# EAGLE design EL_Inverter (EAGLE 7.2.0)
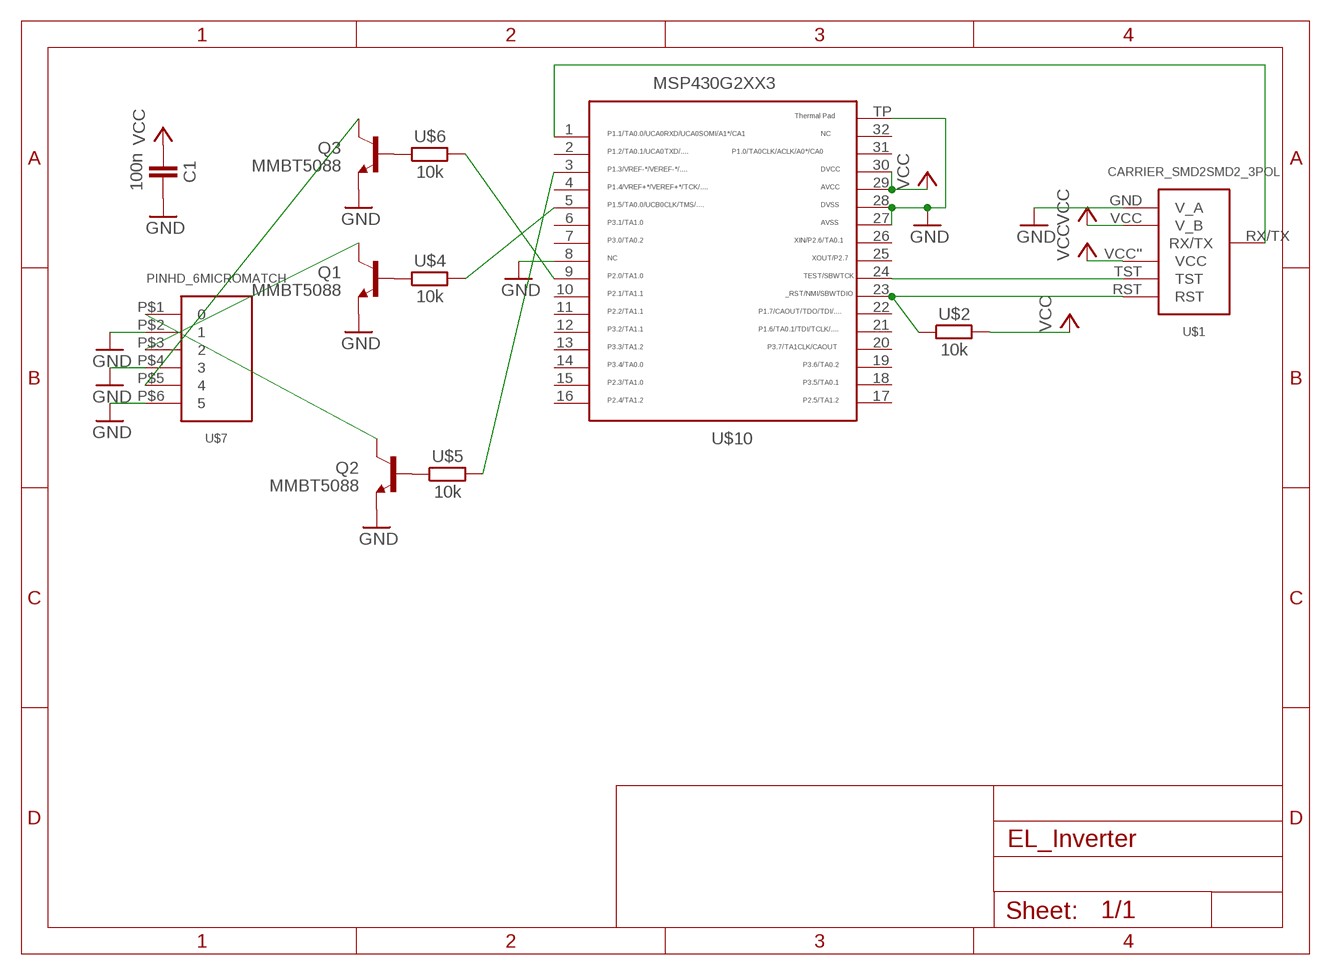
[diagram p0: schematic, sheet 1]

## Parts
C1  100n  CAPACITOR  [603]
Q1  MMBT5088  TRANSISTOR_NPNMMBT5088  [SOT23-3]
Q2  MMBT5088  TRANSISTOR_NPNMMBT5088  [SOT23-3]
Q3  MMBT5088  TRANSISTOR_NPNMMBT5088  [SOT23-3]
U$1  CARRIER_SMD2SMD2_3POL  [CARRIER_SMD2_3POL]
U$2  10k  RESISTOR0603  [603]
U$4  10k  RESISTOR0603  [603]
U$5  10k  RESISTOR0603  [603]
U$6  10k  RESISTOR0603  [603]
U$7  PINHD_6MICROMATCH  [MICROMATCH6POL]
U$10  MSP430G2553  [QFN32]

## Nets
GND: C1.2 Q1.2(E) Q2.2(E) Q3.2(E) U$1.GND(V_A) U$7.P$2 U$7.P$4 U$7.P$6 U$10.8 U$10.27 U$10.28 U$10.TP
N$2: Q1.1(B) U$4.1
N$3: U$1.TST U$10.24
N$4: U$1.RST U$2.1 U$10.23
N$5: Q2.1(B) U$5.1
N$6: Q2.3(C) U$7.P$1
N$7: Q1.3(C) U$7.P$3
N$11: Q3.1(B) U$6.1
N$12: U$1.RX/TX U$10.1
N$13: Q3.3(C) U$7.P$5
N$14: U$5.2 U$10.3
N$16: U$4.2 U$10.5
N$17: U$6.2 U$10.9
VCC: C1.1 U$1.VCC''(VCC) U$1.VCC(V_B) U$2.2 U$10.29 U$10.30
Unconnected: U$10.2 U$10.4 U$10.6 U$10.7 U$10.10 U$10.11 U$10.12 U$10.13 U$10.14 U$10.15 U$10.16 U$10.17 U$10.18 U$10.19 U$10.20 U$10.21 U$10.22 U$10.25 U$10.26 U$10.31 U$10.32

## Library data of the parts
C1 = thar:CAPACITOR
Q1-Q3 = SparkFun-DiscreteSemi:TRANSISTOR_NPN: Generic NPN BJT MMBT2222A - TRANS-08049 (SOT-23, 1A 40V) MPSA42 - TRANS-09116 (SOT-23, 500mA 300V) MMBT5088LT1G - TRANS-11160 (SOT-23, 50 mA 30V) BC547 - COM-08928 <http://www.sparkfun.com/products/8928> (TO-92 45V 100mA) (1.Collector 2.Base 3.Emitter) 2N3904 - COM-00521 <http://www.sparkfun.com/products/521> (TO-92 40V 200mA) (1.Emitter 2.Base 3.Collector) P2N2222A - COM-12852 <http://www.sparkfun.com/products/12852> (TO-92 40V 600mA) (1.Collector 2.Base 3.Emitter); PROD_ID: TRANS-11160
U$1 = thar:CARRIER_SMD2
U$2 U$4-U$6 = thar:RESISTOR
U$7 = thar:PINHD_6
U$10 = thar:MSP430G2553: TEXAS INSTRUMENTS MSP430G2553IRHB32R MCU, 16BIT, MSP430, 16MHZ, QFN-32 Farnell Best.Nr.: 2325726 Herst.Bez.: MSP430G2553IRHB32R

## Board
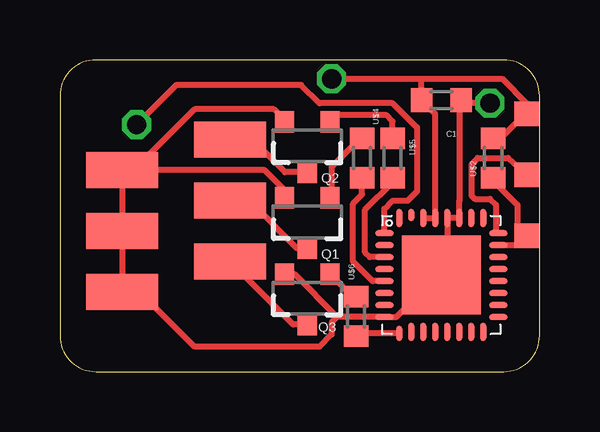
[diagram p1: board, top side]
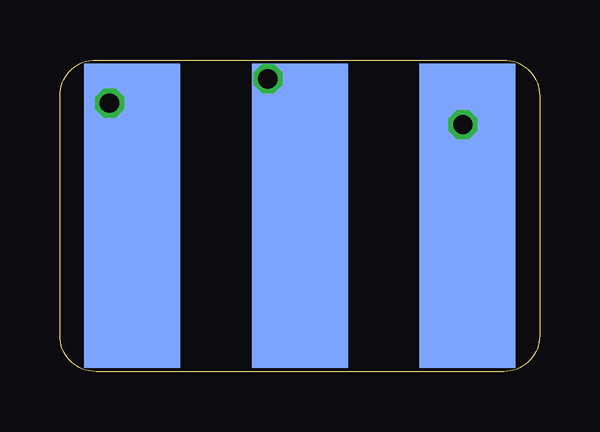
[diagram p2: board, bottom side, seen from below]

Size 20 x 13 mm. Coordinates in mm from the lower left corner, seen from the top.
Copper layers (1*16): Top 0.035mm / dielectric 1.5mm / Bottom 0.035mm
Design rules "Bilex DRU *": minimum track width 10mil, minimum drill 24mil, track to track 10mil, track to pad 10mil, pad to pad 10mil, via to via 10mil, smd to smd 10mil, copper to edge 1mil, drill to drill 8mil, minimum pad ring 10mil, minimum via ring 8mil, stop-mask expansion 4mil, vias tented up to drill 0mil, thermal gap 10mil

### Footprints (pad centres in the part's own frame; a part is rotated, then mirrored left to right if it is on the bottom)
603 = smd 0.889 x 1.016: 1 -0.826,0; 2 0.826,0
SOT23-3 = smd 0.8 x 0.9: 1 -0.95,-1; 2 0.95,-1; 3 0,1.1
CARRIER_SMD2_3POL = smd 4 x 12.7 bottom: GND -6.985,0; RX/TX 6.985,0; VCC 0,0 | smd 1.016 x 1.016: RST -9.461,0.826; TST -9.461,-1.714; VCC'' -9.461,-4.255
MICROMATCH6POL = smd 1.5 x 3: P$1 -3.175,2.25; P$2 -1.905,-2.25; P$3 -0.635,2.25; P$4 0.635,-2.25; P$5 1.905,2.25; P$6 3.175,-2.25
QFN32 = smd 0.762 x 0.254: 1 -2.375,1.75; 2 -2.375,1.25; 3 -2.375,0.75; 4 -2.375,0.25; 5 -2.375,-0.25; 6 -2.375,-0.75; 7 -2.375,-1.25; 8 -2.375,-1.75; 17 2.375,-1.75; 18 2.375,-1.25; 19 2.375,-0.75; 20 2.375,-0.25; 21 2.375,0.25; 22 2.375,0.75; 23 2.375,1.25; 24 2.375,1.75 | smd 0.254 x 0.635: 9 -1.75,-2.438 | smd 0.254 x 0.762: 10 -1.25,-2.375; 11 -0.75,-2.375; 12 -0.25,-2.375; 13 0.25,-2.375; 14 0.75,-2.375; 15 1.25,-2.375; 16 1.75,-2.375; 25 1.75,2.375; 26 1.25,2.375; 27 0.75,2.375; 28 0.25,2.375; 29 -0.25,2.375; 30 -0.75,2.375; 32 -1.75,2.375 | smd 0.254 x 0.508: 31 -1.25,2.5 | smd 3.302 x 3.302: TP 0,0

### Placement (x,y rotation side)
C1  15.9,11.32 0 top
Q1  10.31,6.24 180 top
Q2  10.31,9.42 180 top
Q3  10.31,3.07 180 top
U$1  10,6.5 180 top
U$2  18.06,8.91 90 top
U$4  12.6,8.91 270 top
U$5  13.87,8.91 270 top
U$6  12.35,2.31 270 top
U$7  4.85,6.5 270 top
U$10  15.9,4.03 0 top

### Tracks (layer width: path | path; a pad name or v marks a point on that pad's centre or on a via)
GND  (via drill 0.8)
  Top 0.254: 16.43,4.35 16.19,5.38 16.16,5.35 | 16.43,4.35 16.48,3.06 U$10.TP 15.01,2.94 14.89,3.14 14.03,2.28 U$10.8 11.56,2.28 | 16.15,4.72 U$10.28 U$10.27 16.65,7.12 16.66,7.13 16.66,11.26 C1.2 16.86,11.2 v17.93,11.2 | 16.15,4.72 16.15,4.42 16.43,4.35 | 14.76,5.55 15.52,5.35 16.15,4.72 | U$7.P$2 U$7.P$4 U$7.P$6 3.33,3.32 5.62,1.04 10.82,1.04 11.33,1.54 11.33,2.05 11.56,2.28 | Q2.2 9.37,10.49 8.92,10.94 5.62,10.94 3.46,8.78 2.99,8.78 U$7.P$2 | Q1.2 9.37,7.57 8.54,8.4 U$7.P$2 | Q3.2 9.77,4.07 11.56,2.28
  Bottom 0.254: 18,6.5 17.93,6.57 v17.93,11.2 16.98,10.25 U$1.GND
N$2
  Top 0.254: U$4.1 12.54,9.74 11.33,8.53 11.33,7.31 Q1.1
N$3
  Top 0.254: 19.61,7.88 19.46,8.02 19.5,8.18 | U$10.24 18.19,5.78 18.19,6.95 17.93,7.21 17.3,7.21 17.17,7.33 17.17,8.66 17.43,8.91 18.7,8.91 19.5,8.18 | 19.5,8.18 U$1.TST
N$4
  Top 0.254: 19.46,5.48 19.5,5.38 | 19.46,5.48 19.5,5.69 19.08,5.74 19.08,6.95 18.06,7.97 U$2.1 | U$10.23 19.28,5.28 19.46,5.48 | U$1.RST 19.46,5.48
N$5
  Top 0.254: U$5.1 13.87,10.43 13.62,10.69 11.54,10.69 Q2.1
N$6
  Top 0.254: Q2.3 9.38,8.32 8.28,9.42 7.36,9.42 U$7.P$1
N$7
  Top 0.254: Q1.3 9.89,5.14 7.9,7.13 U$7.P$3
N$11
  Top 0.254: U$6.1 12.2,3.13 Q3.1
N$12  (via drill 0.8)
  Top 0.254: v3.2,10.31 4.85,11.96 10.06,11.96 10.82,11.2 13.87,11.2 14.89,10.18 14.89,7.51 14.51,7.13 13.87,7.13 13.53,6.79 U$10.1
  Bottom 0.254: U$1.RX/TX 3.01,11.77 v3.2,10.31
N$13
  Top 0.254: Q3.3 9.73,1.97 U$7.P$5
N$14
  Top 0.254: U$10.3 12.92,4.78 12.73,4.97 12.73,6.75 13.87,7.89 U$5.2
N$16
  Top 0.254: U$10.5 13.03,3.78 12.22,4.59 12.22,7.01 12.6,7.39 U$4.2
N$17
  Top 0.254: U$10.9 12.46,1.59 U$6.2
VCC  (via drill 0.8)
  Top 0.254: 19.5,10.52 19.46,10.56 | U$2.2 18.12,9.48 19.2,10.56 19.2,10.51 19.46,10.56 | 19.5,11.11 19.65,10.95 19.65,10.75 19.46,10.56 | U$1.VCC'' 19.46,11.07 19.5,11.11 | 19.5,11.11 19.5,11.16 18.44,12.21 15.01,12.21 | U$10.30 U$10.29 15.65,10.75 C1.1 15.08,12.15 15.01,12.21 | v11.33,12.21 15.01,12.21
  Bottom 0.254: U$1.VCC 10,10.25 | 10,10.25 v11.33,12.21 | 10,10.25 9.49,10.25 9.04,10.69